# EAGLE design Cooling rev5 (EAGLE 8.1.0)
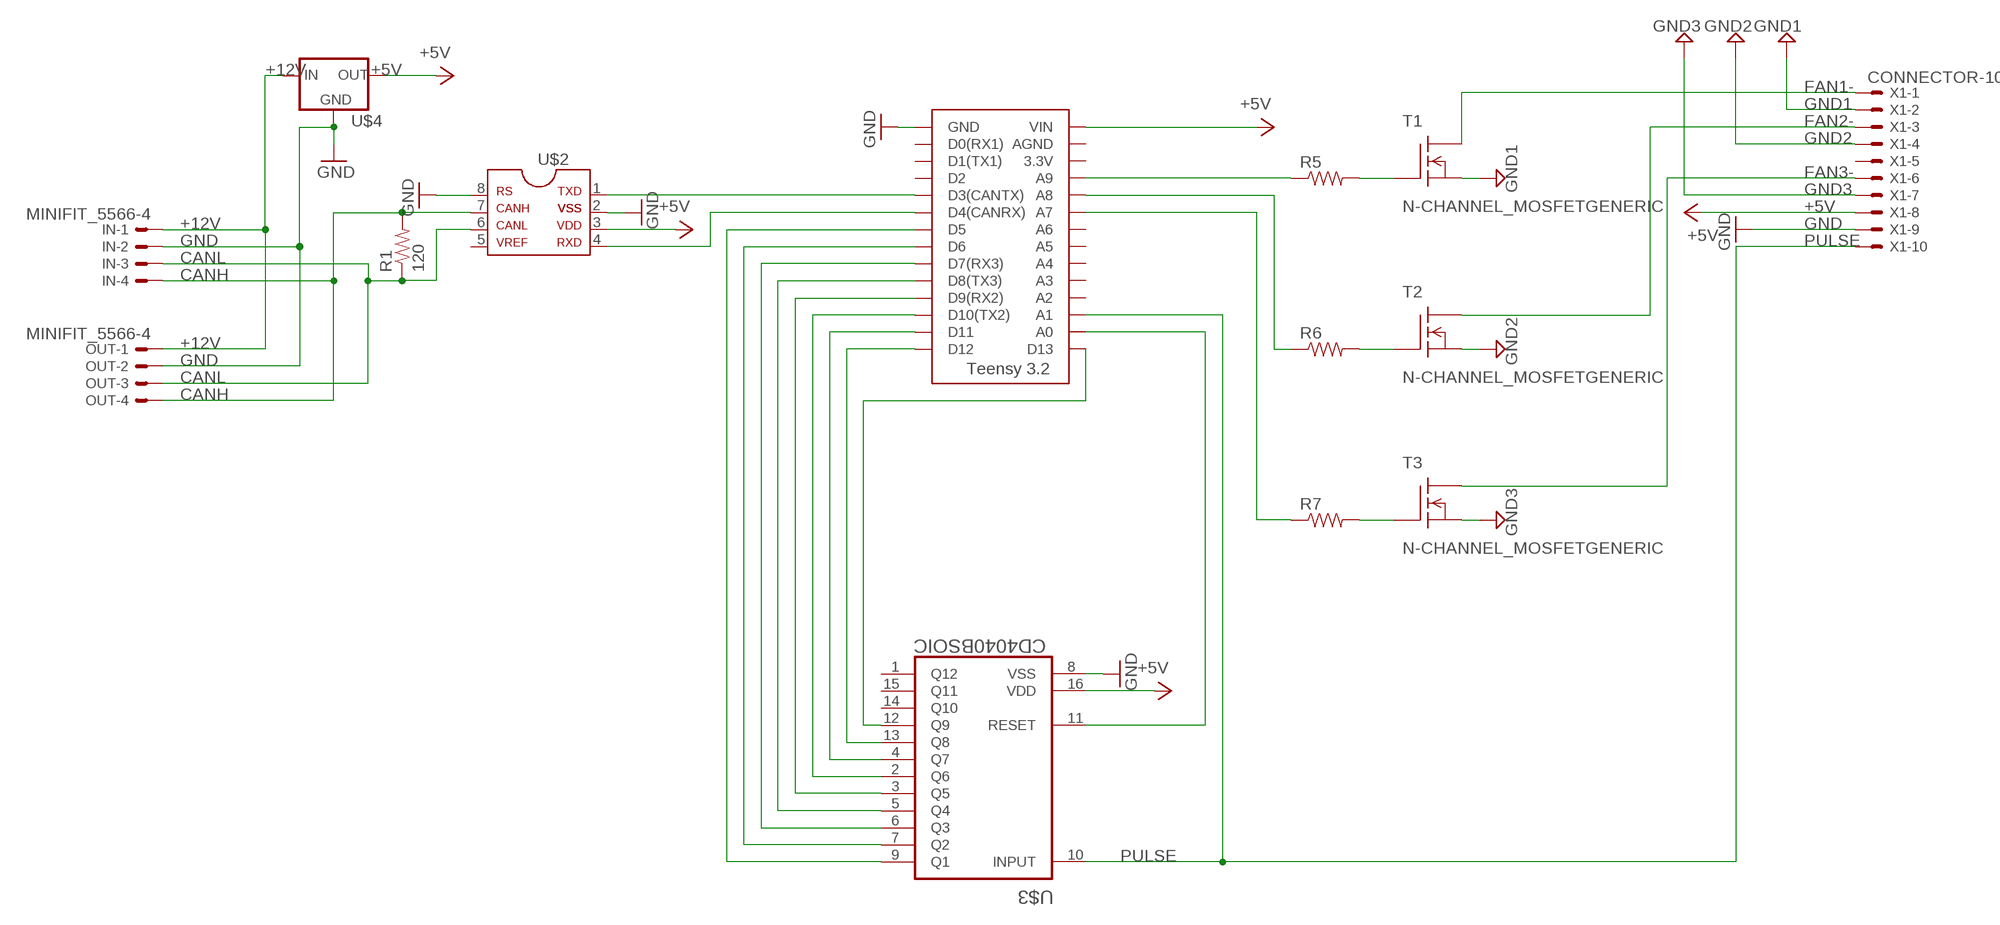
[diagram p0: schematic, sheet 1]

## Parts
IN  MINIFIT_5566-4  [MINIFIT_5566-4]
OUT  MINIFIT_5566-4  [MINIFIT_5566-4]
R1  120  RESISTOR0805-RES  [0805]
R5  RESISTORPTH-1/4W  [AXIAL-0.4]
R6  RESISTORPTH-1/4W  [AXIAL-0.4]
R7  RESISTORPTH-1/4W  [AXIAL-0.4]
T1  N-CHANNEL_MOSFETGENERIC  [TO-220-SINK]
T2  N-CHANNEL_MOSFETGENERIC  [TO-220-SINK]
T3  N-CHANNEL_MOSFETGENERIC  [TO-220-SINK]
U$1  TEENSY_3.2_SIMPLE  [TEENSY_3.2_SIMPLE]
U$2  MCP2551  [SOIC-08]
U$3  CD4040BSOIC  [SOIC-16]
U$4  5V_REGULATOR_LM340-NLM340MPX-5.0/NOPB  [SOT223]
X1  CONNECTOR-10  [MINIFIT_5566-10]

## Nets
+5V: U$1.VIN U$2.3 U$3.16(VDD) U$4.3(OUT) X1.8
+12V: IN.1 OUT.1 U$4.1(IN)
CANH: IN.4 OUT.4 R1.2 U$2.7
CANL: IN.3 OUT.3 R1.1 U$2.6
FAN1-: T1.2(D) X1.1
FAN2-: T2.2(D) X1.3
FAN3-: T3.2(D) X1.6
GND: IN.2 OUT.2 U$1.GND U$2.2 U$2.8 U$3.8(VSS) U$4.2(GND) U$4.4(GND) X1.9
GND1: T1.3(S) X1.2
GND2: T2.3(S) X1.4
GND3: T3.3(S) X1.7
N$1: R5.P$2 T1.1(G)
N$2: U$1.D3(CANTX) U$2.1
N$3: U$1.D4(CANRX) U$2.4
N$4: R6.P$2 T2.1(G)
N$6: R7.P$2 T3.1(G)
N$12: U$1.D5 U$3.9(Q1)
N$13: U$1.D6 U$3.7(Q2)
N$14: U$1.D7(RX3) U$3.6(Q3)
N$15: U$1.D8(TX3) U$3.5(Q4)
N$16: U$1.D9(RX2) U$3.3(Q5)
N$17: U$1.D10(TX2) U$3.2(Q6)
N$18: R5.P$1 U$1.A9
N$19: R6.P$1 U$1.A8
N$20: R7.P$1 U$1.A7
N$21: U$1.D11 U$3.4(Q7)
N$22: U$1.D12 U$3.13(Q8)
N$23: U$1.A0 U$3.11(RESET)
N$24: U$1.D13 U$3.12(Q9)
PULSE: U$1.A1 U$3.10(INPUT) X1.10
Unconnected: U$1.3.3V U$1.A2 U$1.A3 U$1.A4 U$1.A5 U$1.A6 U$1.AGND U$1.D0(RX1) U$1.D1(TX1) U$1.D2 U$2.5 U$3.1(Q12) U$3.14(Q10) U$3.15(Q11) X1.5

## Library data of the parts
IN OUT = HyTechDevices:MINIFIT_5566-4: Mini-Fit Junior connector 4 pole Source: http://www.molex.com; OC_FARNELL: unknown; OC_NEWARK: unknown
R1 R5-R7 = HyTechDevices:RESISTOR: Resistor Basic schematic elements and footprints for 0603, 1206, and PTH resistors.
T1-T3 = HyTechDevices:N-CHANNEL_MOSFET: Generic N-Channel MOSFET; _EXTERNAL_: 1
U$1 = HyTechDevices:TEENSY_3.2_SIMPLE: Simple version of the Teensy 3.2 board that only uses the 2 main rows of pins, not the inner pins or the pins opposite the usb port.
U$2 = HyTechDevices:MCP2551: MCP2551 High-Speed CAN Transceiver Product Webpage <https://www.microchip.com/wwwproducts/en/MCP2551> Datasheet <http://ww1.microchip.com/downloads/en/DeviceDoc/21667f.pdf> This device is outdated It is replaced by MCP2561. Comparison Page <https://www.microchip.com/wwwproducts/ProductCompare/MCP2551/MCP2561> Product Webpage <https://www.microchip.com/wwwproducts/en/MCP2561> Datasheet <http://ww1.microchip.com/downloads/en/DeviceDoc/20005167C.pdf>
U$3 = HyTechDevices:CD4040B: Texas Instruments CD4040B 12-Stage Binary Counter/Divider CMOS Ripple-Carry 12-Stage Binary Counter/Divider
U$4 = HyTechDevices:5V_REGULATOR_LM340-N: Voltage Regulator 5v linear voltage regulator Datasheet <http://www.mouser.com/ProductDetail/Texas-Instruments/LM340MPX-50-NOPB/?qs=X1J7HmVL2ZGZwtTFRQ9ItA%3D%3D> MAX current out: 1.5A MAX voltage in: 35V
X1 = HyTechDevices:CONNECTOR-10: Mini-Fit Junior connector 10 pole Source: http://www.molex.com; OC_FARNELL: unknown; OC_NEWARK: unknown

## Board
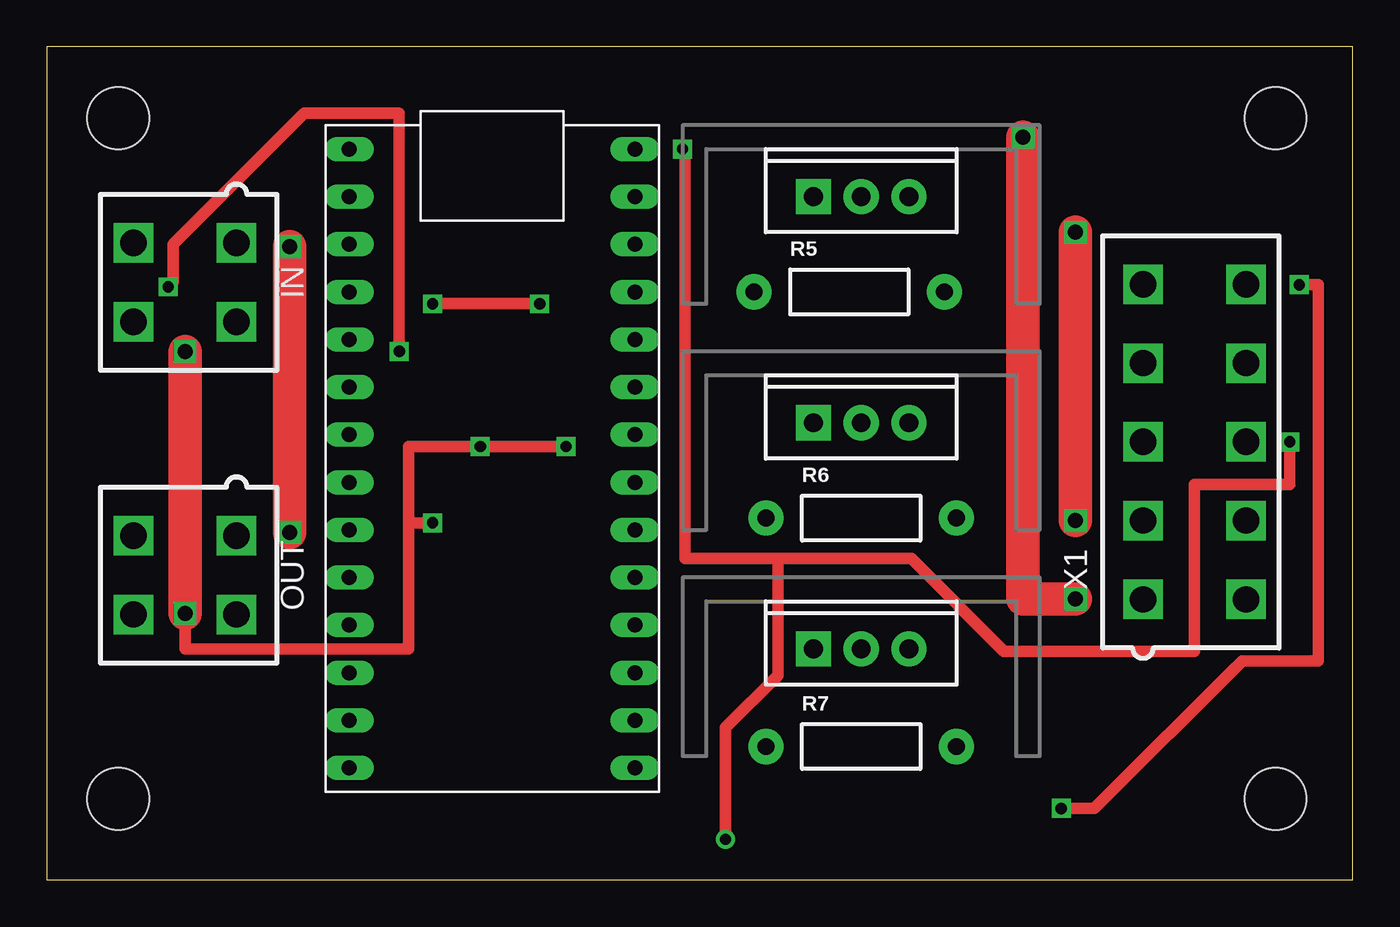
[diagram p1: board, top side]
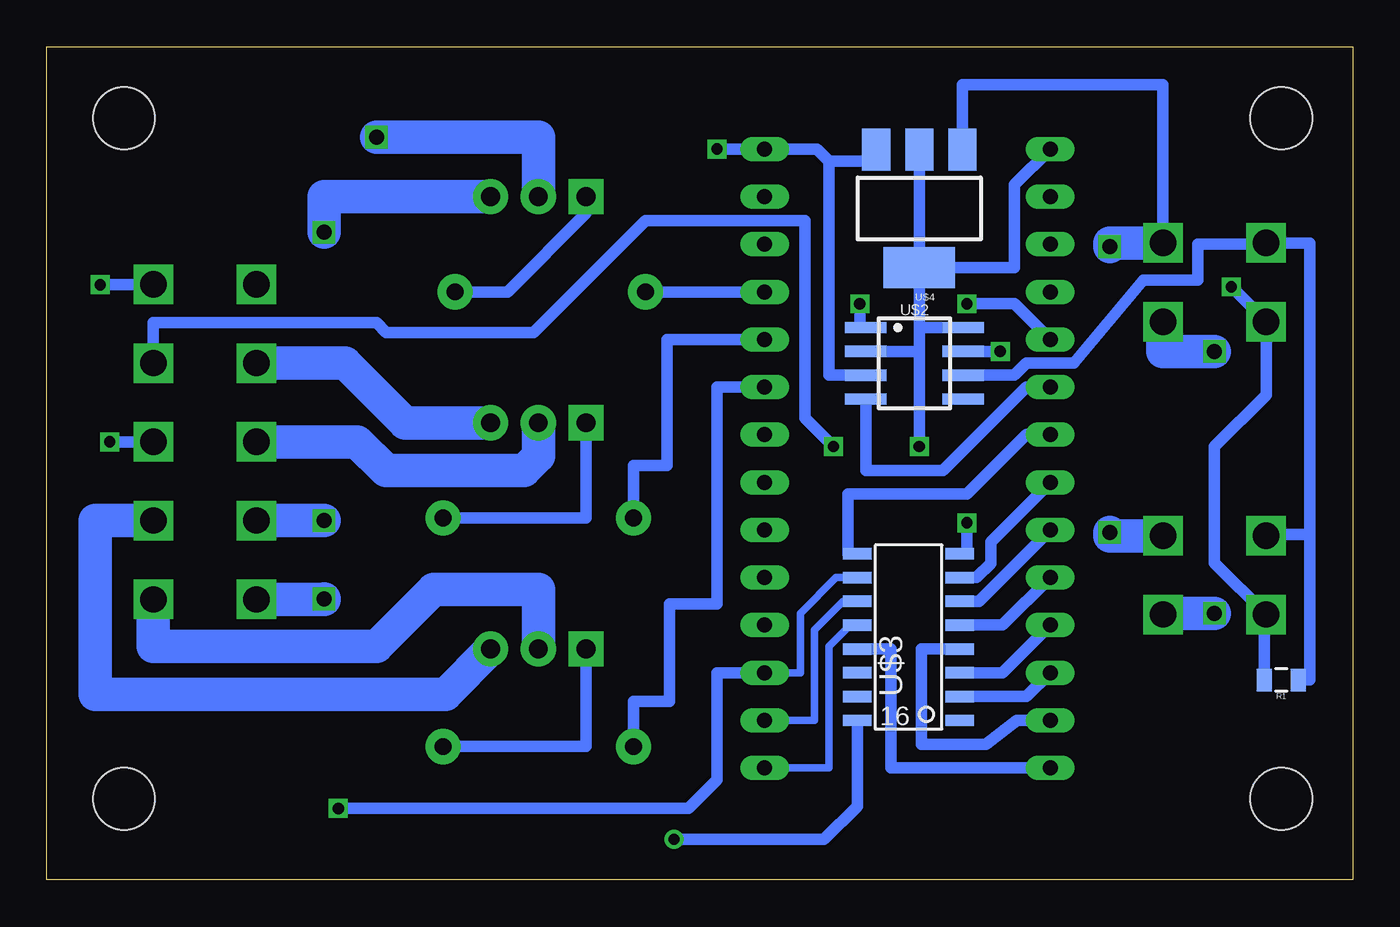
[diagram p2: board, bottom side, seen from below]

Size 69.65 x 44.44 mm. Coordinates in mm from the lower left corner, seen from the top.
Outline: 0,0 69.65,0 69.65,44.44 0,44.44 0,0
Copper layers (1*16): Top 0.035mm / dielectric 1.5mm / Bottom 0.035mm
Design rules "default *": minimum track width 10mil, minimum drill 24mil, track to track 16mil, track to pad 16mil, pad to pad 16mil, via to via 16mil, smd to smd 16mil, copper to edge 40mil, drill to drill 8mil, minimum pad ring 10mil, minimum via ring 8mil, stop-mask expansion 4mil, vias tented up to drill 0mil, thermal gap 10mil
Holes 3.3 mm at 65.53,40.64 3.81,40.64 65.53,4.32 3.81,4.32

### Footprints (pad centres in the part's own frame; a part is rotated, then mirrored left to right if it is on the bottom)
MINIFIT_5566-4 = drill 1.4 square: 1 2.1,-2.75; 2 -2.1,-2.75; 3 2.1,2.75; 4 -2.1,2.75
0805 = smd 0.8 x 1.2: 1 -0.9,0; 2 0.9,0
AXIAL-0.4 = drill 0.9 pad 1.88: P$1 -5.08,0; P$2 5.08,0
TO-220-SINK = drill 1 pad 1.88 square: 1 -2.54,0 | drill 1 pad 1.88: 2 0,0; 3 2.54,0
TEENSY_3.2_SIMPLE = drill 0.8 long: 3.3V 16.51,29.21; A0 16.51,3.81; A1 16.51,6.35; A2 16.51,8.89; A3 16.51,11.43; A4 16.51,13.97; A5 16.51,16.51; A6 16.51,19.05; A7 16.51,21.59; A8 16.51,24.13; A9 16.51,26.67; AGND 16.51,31.75; D0(RX1) 1.27,31.75; D1(TX1) 1.27,29.21; D2 1.27,26.67; D3(CANTX) 1.27,24.13; D4(CANRX) 1.27,21.59; D5 1.27,19.05; D6 1.27,16.51; D7(RX3) 1.27,13.97; D8(TX3) 1.27,11.43; D9(RX2) 1.27,8.89; D10(TX2) 1.27,6.35; D11 1.27,3.81; D12 1.27,1.27; D13 16.51,1.27; GND 1.27,34.29; VIN 16.51,34.29
SOIC-08 = smd 0.6 x 2.2: 1 -1.905,-2.6; 2 -0.635,-2.6; 3 0.635,-2.6; 4 1.905,-2.6; 5 1.905,2.6; 6 0.635,2.6; 7 -0.635,2.6; 8 -1.905,2.6
SOIC-16 = smd 0.61 x 1.524: 1 -4.445,-2.794; 2 -3.175,-2.794; 3 -1.905,-2.794; 4 -0.635,-2.794; 5 0.635,-2.794; 6 1.905,-2.794; 7 3.175,-2.794; 8 4.445,-2.794; 9 4.445,2.667; 10 3.175,2.667; 11 1.905,2.667; 12 0.635,2.667; 13 -0.635,2.667; 14 -1.905,2.667; 15 -3.175,2.667; 16 -4.445,2.667
SOT223 = smd 1.5 x 2.235: 1 -2.3,-3.15; 2 0,-3.15; 3 2.3,-3.15 | smd 3.8 x 2.2: 4 0,3.15
MINIFIT_5566-10 = drill 1.4 square: 1 8.4,-2.75; 2 4.2,-2.75; 3 0,-2.75; 4 -4.2,-2.75; 5 -8.4,-2.75; 6 8.4,2.75; 7 4.2,2.75; 8 0,2.75; 9 -4.2,2.75; 10 -8.4,2.75

### Placement (x,y rotation side)
IN  7.37,31.88 90 top
OUT  7.37,16.26 90 top
R1  3.81,10.67 180 bottom
R5  42.8,31.37 0 top
R6  43.43,19.3 0 top
R7  43.43,7.11 0 top
T1  43.43,36.45 0 top
T2  43.43,24.38 0 top
T3  43.43,12.32 0 top
U$1  14.86,4.7 0 top
U$2  23.37,27.56 270 bottom
U$3  23.75,12.95 90 bottom
U$4  23.11,35.81 180 bottom
X1  61.21,23.37 270 top

### Tracks (layer width: path | path; a pad name or v marks a point on that pad's centre or on a via)
+5V  (via drill 0.6)
  Top 0.61: v36.2,2.16 36.2,8.13 38.99,10.92 38.99,17.14 | 38.99,17.14 34.04,17.14 34.04,38.99 v33.91,38.99 | v66.29,23.37 66.29,21.08 61.21,21.08 61.21,12.19 51.05,12.19 46.1,17.14 38.99,17.14
  Bottom 0.61: 27.94,38.35 28.57,38.99 U$1.VIN v33.91,38.99 | 27.94,38.35 27.94,26.92 U$2.3 | U$3.16 26.42,3.94 28.19,2.16 v36.2,2.16 | U$4.3 26.02,38.35 27.94,38.35 | v66.29,23.37 X1.8
+12V  (via drill 0.8)
  Top 1.778: v12.95,33.78 v12.95,18.54
  Bottom 0.61: U$4.1 20.81,42.42 10.12,42.42 IN.1
  Bottom 1.778: IN.1 12.95,33.98 v12.95,33.78 | v12.95,18.54 12.95,18.36 OUT.1
CANH  (via drill 0.6)
  Top 0.61: v18.8,28.19 18.8,40.89 13.72,40.89 6.73,33.91 6.73,31.89 v6.48,31.64
  Bottom 0.406: OUT.4 4.83,14.16
  Bottom 0.61: U$2.7 v18.8,28.19 | v6.48,31.64 IN.4 4.62,25.86 7.37,23.11 7.37,16.91 OUT.4 4.71,14.16 R1.2
CANL
  Bottom 0.406: 4.83,18.36 OUT.3
  Bottom 0.61: 2.29,18.41 2.29,33.98 IN.3 4.62,33.91 8.26,33.91 8.26,32 11.18,32 14.86,27.56 17.4,27.56 18.03,26.92 U$2.6 | 2.29,18.41 4.62,18.41 OUT.3 | 2.29,18.41 2.29,10.67 R1.1
FAN1-  (via drill 0.8)
  Top 1.778: v52.07,39.62 52.07,14.99 v54.86,14.99
  Bottom 1.778: T1.2 43.43,39.62 v52.07,39.62 | v54.86,14.99 54.86,14.97 X1.1
FAN2-
  Bottom 1.778: T2.2 43.43,22.61 44.2,21.84 51.56,21.84 53.09,23.37 X1.3
FAN3-
  Bottom 1.778: T3.2 43.43,15.49 49.02,15.49 52.07,12.45 63.96,12.45 X1.6
GND  (via drill 0.6, 0.8)
  Top 0.61: 19.3,19.05 19.3,12.32 7.37,12.32 v7.37,14.22 | 19.3,19.05 19.3,23.11 v23.11,23.11 v27.69,23.11 | v20.57,19.05 19.3,19.05
  Top 1.778: v7.37,14.22 v7.37,28.19
  Bottom 0.61: 16.13,38.91 U$1.GND 18.03,37.08 18.03,32.66 U$4.4 | U$4.4 U$4.2 | 23.11,28.19 v23.11,23.11 | 23.11,28.19 23.11,29.46 | 23.11,29.46 U$2.8 | U$3.8 20.57,17.4 v20.57,19.05 | 23.11,29.46 U$4.4 | U$2.2 23.11,28.19 | v27.69,23.11 29.21,24.64 29.21,35.18 37.72,35.18 43.69,29.21 51.56,29.21 52.07,29.72 63.96,29.72 X1.9
  Bottom 1.778: v7.37,14.22 10.12,14.22 OUT.2 | IN.2 10.12,28.19 v7.37,28.19
GND1  (via drill 0.8)
  Top 1.778: v54.86,34.54 v54.86,19.17
  Bottom 1.778: T1.3 54.86,36.45 v54.86,34.54 | v54.86,19.17 X1.2
GND2
  Bottom 1.778: T2.3 50.55,24.38 53.73,27.57 X1.4
GND3
  Bottom 1.778: T3.3 48.39,9.91 67.06,9.91 67.06,19.17 X1.7
N$1
  Bottom 0.406: 40.89,36.42 T1.1
  Bottom 0.61: T1.1 40.89,35.56 45.09,31.37 R5.P$2
N$2  (via drill 0.6)
  Top 0.61: v20.57,30.73 v26.29,30.73
  Bottom 0.61: U$1.D3(CANTX) 18.03,30.73 v20.57,30.73 | 26.22,30.73 v26.29,30.73 26.29,29.46 U$2.1
N$3
  Bottom 0.61: U$1.D4(CANRX) 17.4,26.29 21.84,21.84 25.97,21.84 U$2.4
N$4
  Bottom 0.61: T2.1 40.89,19.3 R6.P$2
N$6
  Bottom 0.61: T3.1 40.89,7.11 R7.P$2
N$12
  Bottom 0.305: U$3.9 26.92,17.4
  Bottom 0.61: U$1.D5 17.4,23.75 20.57,20.57 26.92,20.57 26.92,17.4
N$13
  Bottom 0.406: U$3.7 20.07,16.13
  Bottom 0.61: 20.07,16.13 19.3,16.89 19.3,18.03 U$1.D6
N$14
  Bottom 0.61: U$3.6 19.94,14.86 U$1.D7(RX3)
N$15
  Bottom 0.61: U$3.5 18.67,13.59 U$1.D8(TX3)
N$16
  Bottom 0.61: U$3.3 18.67,11.05 U$1.D9(RX2)
N$17
  Bottom 0.61: U$3.2 17.4,9.78 U$1.D10(TX2)
N$18
  Bottom 0.61: U$1.A9 R5.P$1
N$19
  Bottom 0.61: R6.P$1 38.35,22.1 36.58,22.1 36.58,28.83 U$1.A8
N$20
  Bottom 0.61: U$1.A7 33.91,26.29 33.91,14.73 36.45,14.73 36.45,9.53 38.35,9.53 R7.P$1
N$21
  Bottom 0.61: U$3.4 22.99,12.32 22.99,7.24 19.56,7.24 17.91,8.51 U$1.D11
N$22
  Bottom 0.61: U$3.13 24.64,12.32 24.64,5.97 U$1.D12
N$23
  Bottom 0.406: U$1.A0 28.7,8.51 28.7,13.34 27.18,14.86 U$3.11
N$24
  Bottom 0.406: U$1.D13 27.94,5.97 27.94,12.45 26.92,13.46 U$3.12
PULSE  (via drill 0.6)
  Top 0.61: v54.1,3.81 55.88,3.81 63.75,11.68 67.82,11.68 67.82,31.75 v66.8,31.75
  Bottom 0.406: U$3.10 27.56,16.13 29.46,14.22 29.46,11.05 U$1.A1
  Bottom 0.61: U$1.A1 33.91,11.05 33.91,5.33 35.43,3.81 v54.1,3.81 | v66.8,31.75 63.96,31.75 X1.10

### Text on the board
tDocu: hytech_2017_cooling_ecu_rev5